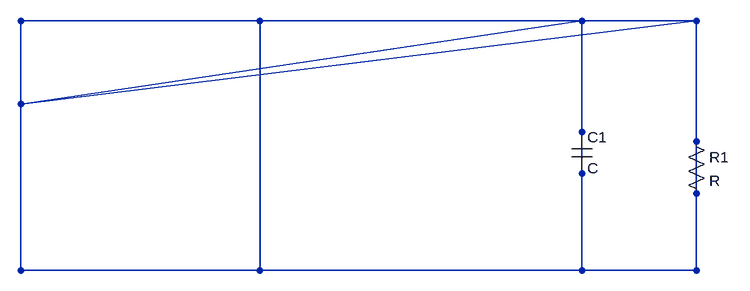
[diagram p0: schematic C138_D1_P1.jpg.asc]
C138_D1_P1.jpg.asc, the LTspice schematic file:
Version 4
SHEET 1 880 680
SYMBOL res 1472 906 R0
SYMATTR InstName R1
SYMBOL cap 1296 907 R0
SYMATTR InstName C1
WIRE 1312 1120 1488 1120
WIRE 448 1120 1312 1120
WIRE 1312 736 1312 1120
WIRE 816 1120 1312 1120
WIRE 448 736 1488 736
WIRE 816 736 1488 736
WIRE 1488 736 1488 1120
WIRE 1312 736 1488 736
WIRE 448 864 1488 736
WIRE 448 736 816 736
WIRE 448 736 448 1120
WIRE 448 736 1312 736
WIRE 448 736 448 864
WIRE 816 736 1312 736
WIRE 816 736 816 1120
WIRE 448 1120 1488 1120
WIRE 816 1120 1488 1120
WIRE 448 1120 816 1120
WIRE 448 864 448 1120
WIRE 448 864 1312 736

The netlist it stands for:
* C138_D1_P1.jpg.asc
R1 N001 N001 R
C1 N001 N001 C
.backanno
.end